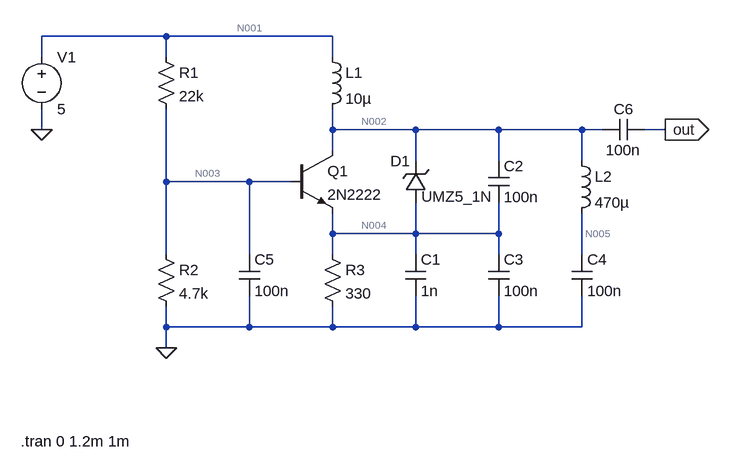
[diagram p0: schematic REM-6.asc]
REM-6.asc, the LTspice schematic file:
Version 4.1
SHEET 1 928 680
WIRE -48 -80 -240 -80
WIRE 208 -80 -48 -80
WIRE -240 -48 -240 -80
WIRE -48 -48 -48 -80
WIRE 208 -48 208 -80
WIRE -240 64 -240 32
WIRE 208 64 208 32
WIRE 336 64 208 64
WIRE 464 64 336 64
WIRE 592 64 464 64
WIRE 624 64 592 64
WIRE 720 64 688 64
WIRE 208 96 208 64
WIRE 336 112 336 64
WIRE 464 112 464 64
WIRE 592 112 592 64
WIRE -48 144 -48 32
WIRE 80 144 -48 144
WIRE 144 144 80 144
WIRE 208 224 208 192
WIRE 336 224 336 176
WIRE 336 224 208 224
WIRE 464 224 464 176
WIRE 464 224 336 224
WIRE -48 256 -48 144
WIRE 80 256 80 144
WIRE 208 256 208 224
WIRE 336 256 336 224
WIRE 464 256 464 224
WIRE 592 256 592 192
WIRE -48 368 -48 336
WIRE 80 368 80 320
WIRE 80 368 -48 368
WIRE 208 368 208 336
WIRE 208 368 80 368
WIRE 336 368 336 320
WIRE 336 368 208 368
WIRE 464 368 464 320
WIRE 464 368 336 368
WIRE 592 368 592 320
WIRE 592 368 464 368
WIRE -48 400 -48 368
FLAG -240 64 0
FLAG -48 400 0
FLAG 720 64 out
IOPIN 720 64 Out
SYMBOL npn 144 96 R0
SYMATTR InstName Q1
SYMATTR Value 2N2222
SYMBOL res -64 -64 R0
SYMATTR InstName R1
SYMATTR Value 22k
SYMBOL res -64 240 R0
SYMATTR InstName R2
SYMATTR Value 4.7k
SYMBOL res 192 240 R0
SYMATTR InstName R3
SYMATTR Value 330
SYMBOL cap 320 256 R0
SYMATTR InstName C1
SYMATTR Value 1n
SYMBOL cap 448 112 R0
SYMATTR InstName C2
SYMATTR Value 100n
SYMBOL cap 448 256 R0
SYMATTR InstName C3
SYMATTR Value 100n
SYMBOL cap 576 256 R0
SYMATTR InstName C4
SYMATTR Value 100n
SYMBOL cap 688 48 R90
WINDOW 0 0 32 VBottom 2
WINDOW 3 32 32 VTop 2
SYMATTR InstName C6
SYMATTR Value 100n
SYMBOL ind 192 -64 R0
SYMATTR InstName L1
SYMATTR Value 10µ
SYMATTR SpiceLine Rser=1m
SYMBOL ind 576 96 R0
SYMATTR InstName L2
SYMATTR Value 470µ
SYMATTR SpiceLine Rser=1m
SYMBOL voltage -240 -64 R0
WINDOW 123 0 0 Left 0
WINDOW 39 0 0 Left 0
SYMATTR InstName V1
SYMATTR Value 5
SYMBOL zener 352 176 R180
WINDOW 0 24 64 Left 2
WINDOW 3 7 9 Right 2
SYMATTR InstName D1
SYMATTR Value UMZ5_1N
SYMATTR Description Diode
SYMATTR Type diode
SYMBOL cap 64 256 R0
SYMATTR InstName C5
SYMATTR Value 100n
TEXT -272 544 Left 2 !.tran 0 1.2m 1m

The netlist it stands for:
* REM-6.asc
Q1 N002 N003 N004 0 2N2222
R1 N001 N003 22k
R2 N003 0 4.7k
R3 N004 0 330
C1 N004 0 1n
C2 N002 N004 100n
C3 N004 0 100n
C4 N005 0 100n
C6 out N002 100n
L1 N001 N002 10µ Rser=1m
L2 N002 N005 470µ Rser=1m
V1 N001 0 5
D1 N004 N002 UMZ5_1N
C5 N003 0 100n
.model D D
.lib standard.dio
.model NPN NPN
.model PNP PNP
.lib standard.bjt
.tran 0 1.2m 1m
.backanno
.end

* Results of the author's LTspice run, read from the files saved beside the schematic
* Operating Point, zero values left out:
*   V(n001) = 5 V
*   V(n002) = 5 V
*   V(n003) = 869.1 mV
*   V(n004) = 228.2 mV
*   V(n005) = 5 V
*   V(out) = 5 V
*   I(D1) = -94.05 µA
*   I(L1) = 688.8 µA
*   I(R1) = 187.8 µA
*   I(R2) = 184.9 µA
*   I(R3) = 691.6 µA
*   I(V1) = -876.5 µA
*   Ib(Q1) = 2.861 µA
*   Ic(Q1) = 594.7 µA
*   Ie(Q1) = -597.6 µA
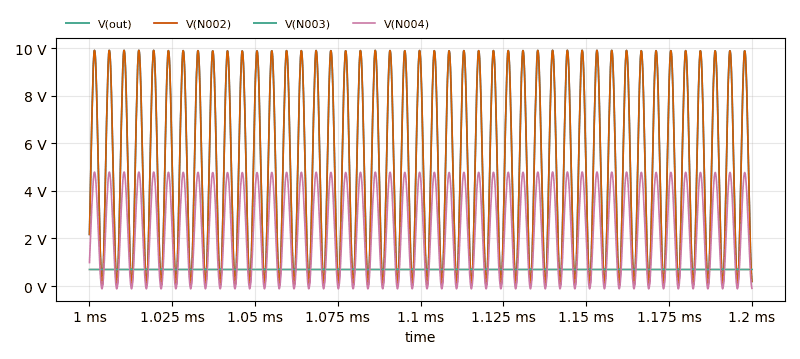
[diagram p1: Transient Analysis of REM-6.asc, plotted from the saved traces]
* Transient Analysis, 1 run:
*   V(out): min 34.38 mV, max 9.902 V, average 5.015 V, rms 6.121 V, last 192.4 mV
*   V(N002): min 34.38 mV, max 9.902 V, average 5.015 V, rms 6.121 V, last 192.4 mV
*   V(N003): min 694.1 mV, max 698.6 mV, average 697.5 mV, rms 697.5 mV, last 697.2 mV
*   V(N004): min -116.1 mV, max 4.791 V, average 2.342 V, rms 2.921 V, last -97.23 mV